# EAGLE design offsets-7x (EAGLE 7.7.0)
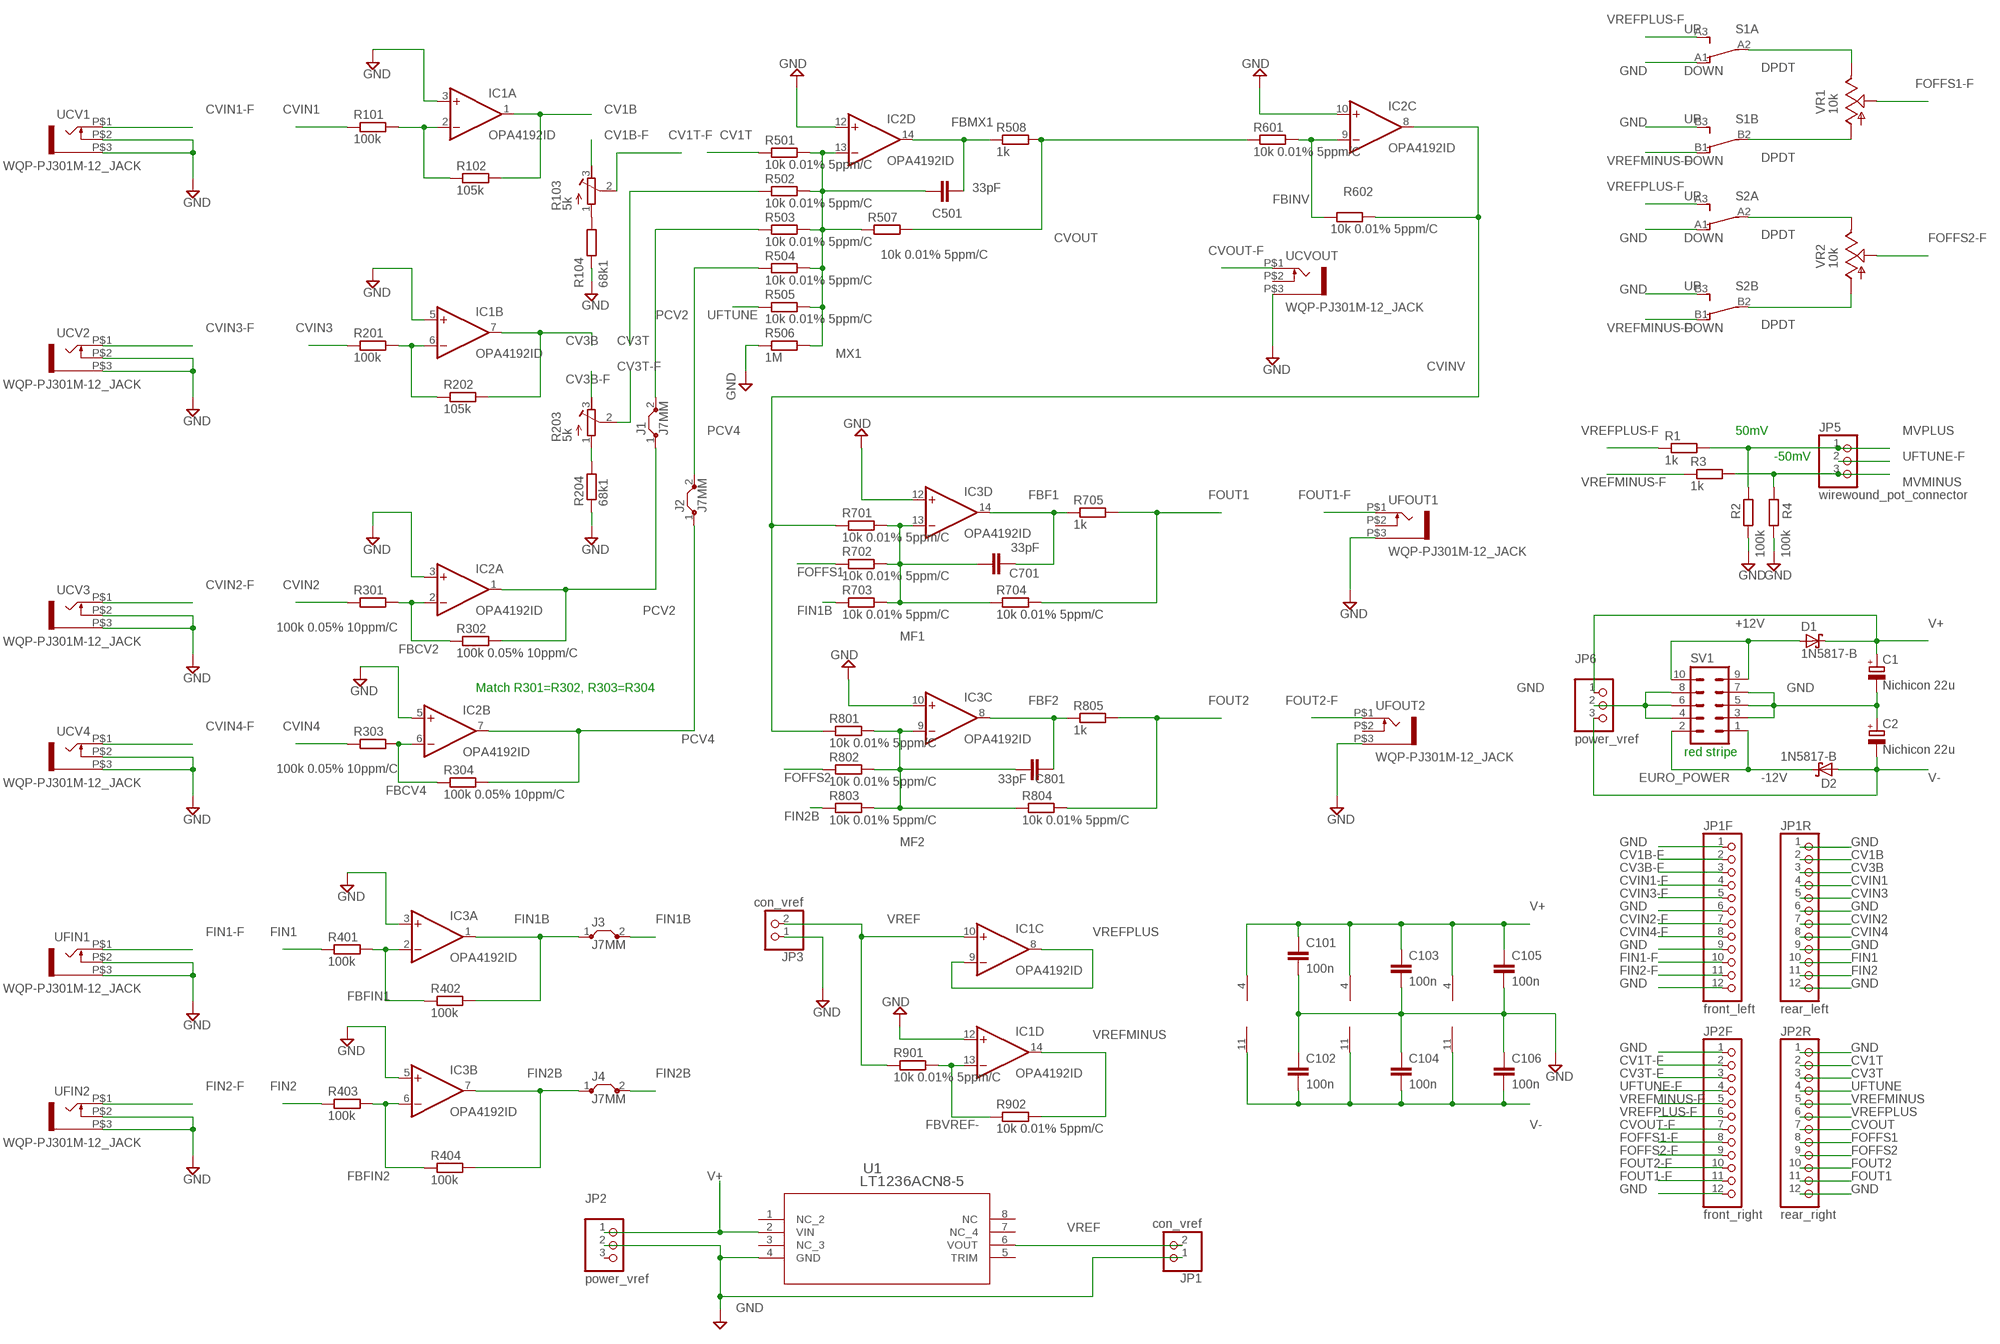
[diagram p0: schematic, sheet 1]

## Parts
C1  Nichicon 22u  CPOL-EUE2.5-5  [E2,5-5]
C2  Nichicon 22u  CPOL-EUE2.5-5  [E2,5-5]
C101  100n  C-EUC1206  [C1206]
C102  100n  C-EUC1206  [C1206]
C103  100n  C-EUC1206  [C1206]
C104  100n  C-EUC1206  [C1206]
C105  100n  C-EUC1206  [C1206]
C106  100n  C-EUC1206  [C1206]
C501  33pF  C-EUC0805K  [C0805K]
C701  33pF  C-EUC0805K  [C0805K]
C801  33pF  C-EUC0805K  [C0805K]
D1  1N5817-B  [DO41-7.6]
D2  1N5817-B  [DO41-7.6]
IC1  OPA4192ID  TL074D  [SO14]
IC2  OPA4192ID  TL074D  [SO14]
IC3  OPA4192ID  TL074D  [SO14]
J1  J7MM  [07]
J2  J7MM  [07]
J3  J7MM  [07]
J4  J7MM  [07]
JP1  con_vref  PINHD-1X2  [1X02]
JP1F  front_left  PINHD-1X12  [1X12]
JP1R  rear_left  PINHD-1X12  [1X12]
JP2  power_vref  PINHD-1X3  [1X03]
JP2F  front_right  PINHD-1X12  [1X12]
JP2R  rear_right  PINHD-1X12  [1X12]
JP3  con_vref  PINHD-1X2  [1X02]
JP5  wirewound_pot_connector  PINHD-1X3  [1X03]
JP6  power_vref  PINHD-1X3  [1X03]
R1  1k  R-EU_R0805W  [R0805W]
R2  100k  R-EU_R0805W  [R0805W]
R3  1k  R-EU_R0805W  [R0805W]
R4  100k  R-EU_R0805W  [R0805W]
R101  100k  R-EU_R0805W  [R0805W]
R102  105k  R-EU_R0805W  [R0805W]
R103  5k  R-TRIMM3296W  [RTRIM3296W]
R104  68k1  R-EU_R0805W  [R0805W]
R201  100k  R-EU_R0805W  [R0805W]
R202  105k  R-EU_R0805W  [R0805W]
R203  5k  R-TRIMM3296W  [RTRIM3296W]
R204  68k1  R-EU_R0805W  [R0805W]
R301  100k 0.05% 10ppm/C  R-EU_R0805W  [R0805W]
R302  100k 0.05% 10ppm/C  R-EU_R0805W  [R0805W]
R303  100k 0.05% 10ppm/C  R-EU_R0805W  [R0805W]
R304  100k 0.05% 10ppm/C  R-EU_R0805W  [R0805W]
R401  100k  R-EU_R0805W  [R0805W]
R402  100k  R-EU_R0805W  [R0805W]
R403  100k  R-EU_R0805W  [R0805W]
R404  100k  R-EU_R0805W  [R0805W]
R501  10k 0.01% 5ppm/C  R-EU_R0805W  [R0805W]
R502  10k 0.01% 5ppm/C  R-EU_R0805W  [R0805W]
R503  10k 0.01% 5ppm/C  R-EU_R0805W  [R0805W]
R504  10k 0.01% 5ppm/C  R-EU_R0805W  [R0805W]
R505  10k 0.01% 5ppm/C  R-EU_R0805W  [R0805W]
R506  1M  R-EU_R0805W  [R0805W]
R507  10k 0.01% 5ppm/C  R-EU_R0805W  [R0805W]
R508  1k  R-EU_R0805W  [R0805W]
R601  10k 0.01% 5ppm/C  R-EU_R0805W  [R0805W]
R602  10k 0.01% 5ppm/C  R-EU_R0805W  [R0805W]
R701  10k 0.01% 5ppm/C  R-EU_R0805W  [R0805W]
R702  10k 0.01% 5ppm/C  R-EU_R0805W  [R0805W]
R703  10k 0.01% 5ppm/C  R-EU_R0805W  [R0805W]
R704  10k 0.01% 5ppm/C  R-EU_R0805W  [R0805W]
R705  1k  R-EU_R0805W  [R0805W]
R801  10k 0.01% 5ppm/C  R-EU_R0805W  [R0805W]
R802  10k 0.01% 5ppm/C  R-EU_R0805W  [R0805W]
R803  10k 0.01% 5ppm/C  R-EU_R0805W  [R0805W]
R804  10k 0.01% 5ppm/C  R-EU_R0805W  [R0805W]
R805  1k  R-EU_R0805W  [R0805W]
R901  10k 0.01% 5ppm/C  R-EU_R0805W  [R0805W]
R902  10k 0.01% 5ppm/C  R-EU_R0805W  [R0805W]
S1  DPDT  DPDT-VERTICAL-DOWNTOP-SUBMINI  [DPDT-VERTICAL-TOP-SUBMINI-MULTICOMP]
S2  DPDT  DPDT-VERTICAL-DOWNTOP-SUBMINI  [DPDT-VERTICAL-TOP-SUBMINI-MULTICOMP]
SV1  EURO_POWER  EURO_POWER_HEADERREGULAR  [EURO_POWER_HEADER]
U1  LT1236ACN8-5  LT1236ACN8-10  [PDIP-8_N]
UCV1  WQP-PJ301M-12_JACK  [WQP-PJ301M-12_JACK]
UCV2  WQP-PJ301M-12_JACK  [WQP-PJ301M-12_JACK]
UCV3  WQP-PJ301M-12_JACK  [WQP-PJ301M-12_JACK]
UCV4  WQP-PJ301M-12_JACK  [WQP-PJ301M-12_JACK]
UCVOUT  WQP-PJ301M-12_JACK  [WQP-PJ301M-12_JACK]
UFIN1  WQP-PJ301M-12_JACK  [WQP-PJ301M-12_JACK]
UFIN2  WQP-PJ301M-12_JACK  [WQP-PJ301M-12_JACK]
UFOUT1  WQP-PJ301M-12_JACK  [WQP-PJ301M-12_JACK]
UFOUT2  WQP-PJ301M-12_JACK  [WQP-PJ301M-12_JACK]
VR1  10k  9MM_SNAP-IN_POT_  [9MM_SNAP-IN_POT]
VR2  10k  9MM_SNAP-IN_POT_  [9MM_SNAP-IN_POT]

## Nets
+12V: D1.A SV1.9 SV1.10
-12V: D2.C SV1.1 SV1.2
CV1B: IC1.1(A:OUT) JP1R.2 R102.2
CV1B-F: JP1F.2 R103.3(E)
CV1T: JP2R.2 R501.1
CV1T-F: JP2F.2 R103.2(S)
CV3B: IC1.7(B:OUT) JP1R.3 R202.2
CV3B-F: JP1F.3 R203.3(E)
CV3T: JP2R.3 R502.1
CV3T-F: JP2F.3 R203.2(S)
CVIN1: JP1R.4 R101.1
CVIN1-F: JP1F.4 UCV1.P$1
CVIN2: JP1R.7 R301.1
CVIN2-F: JP1F.7 UCV3.P$1
CVIN3: JP1R.5 R201.1
CVIN3-F: JP1F.5 UCV2.P$1
CVIN4: JP1R.8 R303.1
CVIN4-F: JP1F.8 UCV4.P$1
CVINV: IC2.8(C:OUT) R602.2 R701.1 R801.1
CVOUT: JP2R.7 R507.2 R508.2 R601.1
CVOUT-F: JP2F.7 UCVOUT.P$1
FBCV2: IC2.2(A:-IN) R301.2 R302.1
FBCV4: IC2.6(B:-IN) R303.2 R304.1
FBF1: C701.2 IC3.14(D:OUT) R705.1
FBF2: C801.2 IC3.8(C:OUT) R805.1
FBFIN1: IC3.2(A:-IN) R401.2 R402.1
FBFIN2: IC3.6(B:-IN) R403.2 R404.1
FBINV: IC2.9(C:-IN) R601.2 R602.1
FBMX1: C501.2 IC2.14(D:OUT) R508.1
FBVREF-: IC1.13(D:-IN) R901.2 R902.1
FIN1: JP1R.10 R401.1
FIN1-F: JP1F.10 UFIN1.P$1
FIN1B: IC3.1(A:OUT) J3.1 J3.2 R402.2 R703.1
FIN2: JP1R.11 R403.1
FIN2-F: JP1F.11 UFIN2.P$1
FIN2B: IC3.7(B:OUT) J4.1 J4.2 R404.2 R803.1
FOFFS1: JP2R.8 R702.1
FOFFS1-F: JP2F.8 VR1.2(S)
FOFFS2: JP2R.9 R802.1
FOFFS2-F: JP2F.9 VR2.2(S)
FOUT1: JP2R.11 R704.2 R705.2
FOUT1-F: JP2F.11 UFOUT1.P$1
FOUT2: JP2R.10 R804.2 R805.2
FOUT2-F: JP2F.10 UFOUT2.P$1
GND: C1.- C2.+ C101.2 C102.1 C103.2 C104.1 C105.2 C106.1 IC1.3(A:+IN) IC1.5(B:+IN) IC1.12(D:+IN) IC2.3(A:+IN) IC2.5(B:+IN) IC2.10(C:+IN) IC2.12(D:+IN) IC3.3(A:+IN) IC3.5(B:+IN) IC3.10(C:+IN) IC3.12(D:+IN) JP1.1 JP1F.1 JP1F.6 JP1F.9 JP1F.12 JP1R.1 JP1R.6 JP1R.9 JP1R.12 JP2.2 JP2F.1 JP2F.12 JP2R.1 JP2R.12 JP3.1 JP6.2 R2.1 R4.1 R104.1 R204.1 R506.1 S1.A1 S1.B3 S2.A1 S2.B3 SV1.3 SV1.4 SV1.5 SV1.6 SV1.7 SV1.8 U1.4(GND) UCV1.P$2 UCV1.P$3 UCV2.P$2 UCV2.P$3 UCV3.P$2 UCV3.P$3 UCV4.P$2 UCV4.P$3 UCVOUT.P$3 UFIN1.P$2 UFIN1.P$3 UFIN2.P$2 UFIN2.P$3 UFOUT1.P$3 UFOUT2.P$3
MF1: C701.1 IC3.13(D:-IN) R701.2 R702.2 R703.2 R704.1
MF2: C801.1 IC3.9(C:-IN) R801.2 R802.2 R803.2 R804.1
MVMINUS: JP5.3 R3.2 R4.2
MVPLUS: JP5.1 R1.2 R2.2
MX1: C501.1 IC2.13(D:-IN) R501.2 R502.2 R503.2 R504.2 R505.2 R506.2 R507.1
N$1: IC1.2(A:-IN) R101.2 R102.1
N$3: IC1.6(B:-IN) R201.2 R202.1
N$5: R103.1(A) R104.2
N$6: R203.1(A) R204.2
N$27: S1.A2 VR1.3(E)
N$28: S1.B2 VR1.1(A)
N$29: S2.A2 VR2.3(E)
N$30: S2.B2 VR2.1(A)
PCV2: IC2.1(A:OUT) J1.1 J1.2 R302.2 R503.1
PCV4: IC2.7(B:OUT) J2.1 J2.2 R304.2 R504.1
UFTUNE: JP2R.4 R505.1
UFTUNE-F: JP2F.4 JP5.2
V+: C1.+ C101.1 C103.1 C105.1 D1.C IC1.4(P:V+) IC2.4(P:V+) IC3.4(P:V+) JP2.1 JP6.1 U1.2(VIN)
V-: C2.- C102.2 C104.2 C106.2 D2.A IC1.11(P:V-) IC2.11(P:V-) IC3.11(P:V-) JP6.3
VREF: IC1.10(C:+IN) JP1.2 JP3.2 R901.1 U1.6(VOUT)
VREFMINUS: IC1.14(D:OUT) JP2R.5 R902.2
VREFMINUS-F: JP2F.5 R3.1 S1.B1 S2.B1
VREFPLUS: IC1.8(C:OUT) IC1.9(C:-IN) JP2R.6
VREFPLUS-F: JP2F.6 R1.1 S1.A3 S2.A3
Unconnected: JP2.3 U1.1(NC_2) U1.3(NC_3) U1.5(TRIM) U1.7(NC_4) U1.8(NC) UCVOUT.P$2 UFOUT1.P$2 UFOUT2.P$2

## Notes on the sheet
- 50mV
- -50mV
- Match R301=R302, R303=R304
- red stripe

## Library data of the parts
C1 C2 = rcl:CPOL-EU: POLARIZED CAPACITOR, European symbol; SPICEPREFIX: C
C101-C106 C501 C701 C801 = rcl:C-EU: CAPACITOR, European symbol; SPICEPREFIX: C
D1 D2 = diode:1N581*: 1.0A SCHOTTKY BARRIER RECTIFIER Source: http://www.diodes.com/datasheets/ds23001.pdf
IC1-IC3 = linear:TL074: OP AMP
J1-J4 = jumper:J: Bridge
JP1 JP3 = pinhead:PINHD-1X2: PIN HEADER
JP1F JP1R JP2F JP2R = pinhead:PINHD-1X12: PIN HEADER
JP2 JP5 JP6 = pinhead:PINHD-1X3: PIN HEADER
R1-R4 R101 R102 R104 R201 R202 R204 R301-R304 R401-R404 R501-R508 R601 R602 R701-R705 R801-R805 R901 R902 = rcl:R-EU_: RESISTOR, European symbol; SPICEPREFIX: R
R103 R203 = rcl:R-TRIMM: Trimm resistor; SPICEMODEL: X; SPICEPREFIXL: POT
S1 S2 = Switches:DPDT-VERTICAL-DOWN: Vertical DPDT switch in the down position.; SPICE: R{NAME}A {A.2.NET} {A.1.NET} 1\nR{NAME}B {B.2.NET} {B.1.NET} 1
SV1 = MusicThingModular:EURO_POWER_HEADER: Power Header 10 pin power header for Eurorack Power Supplies Variants with fatter pads for easier soldering, and the LOCK variant which has 5mil offset pins to hold the component in place before soldering
U1 = LT1236:LT1236ACN8-10; MANUFACTURER_PART_NUMBER: lt1236acn810; VENDOR: Linear Technology
UCV1-UCV4 UCVOUT UFIN1 UFIN2 UFOUT1 UFOUT2 = thonkiconn:WQP-PJ301M-12_JACK
VR1 VR2 = MusicThingModular:9MM_SNAP-IN_POT: 9mm vertical snap-in pot, Alpha / Panasonic style

## Board
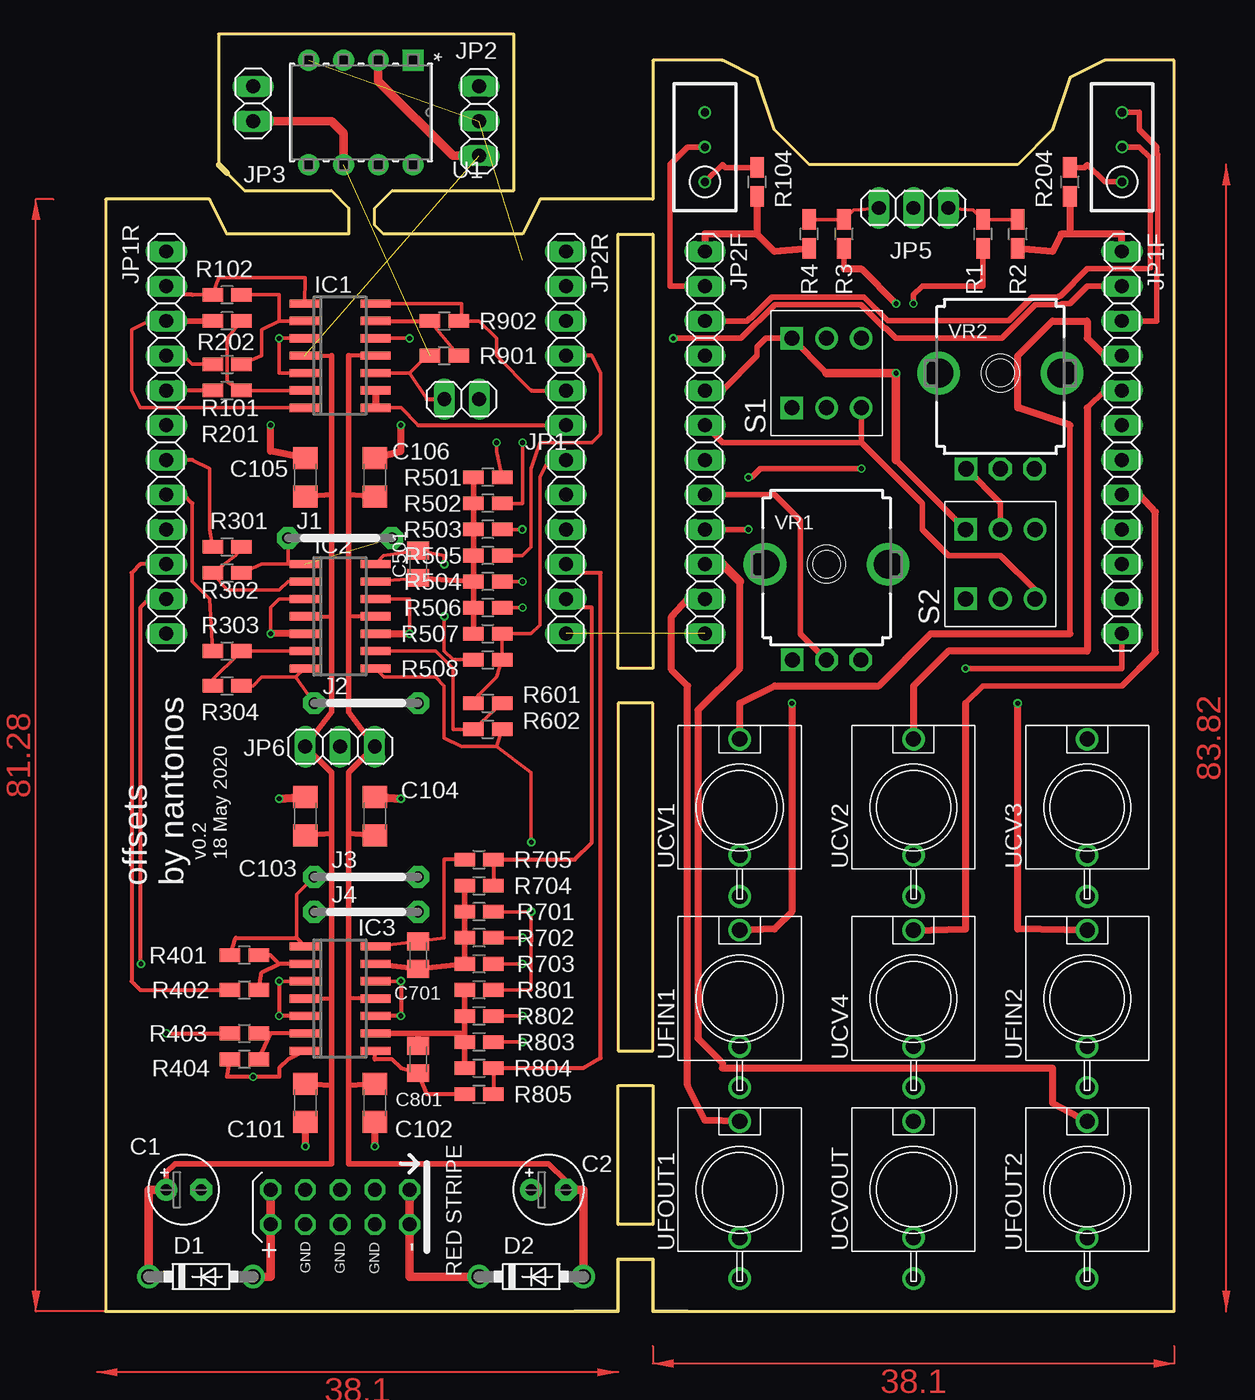
[diagram p1: board, top side]
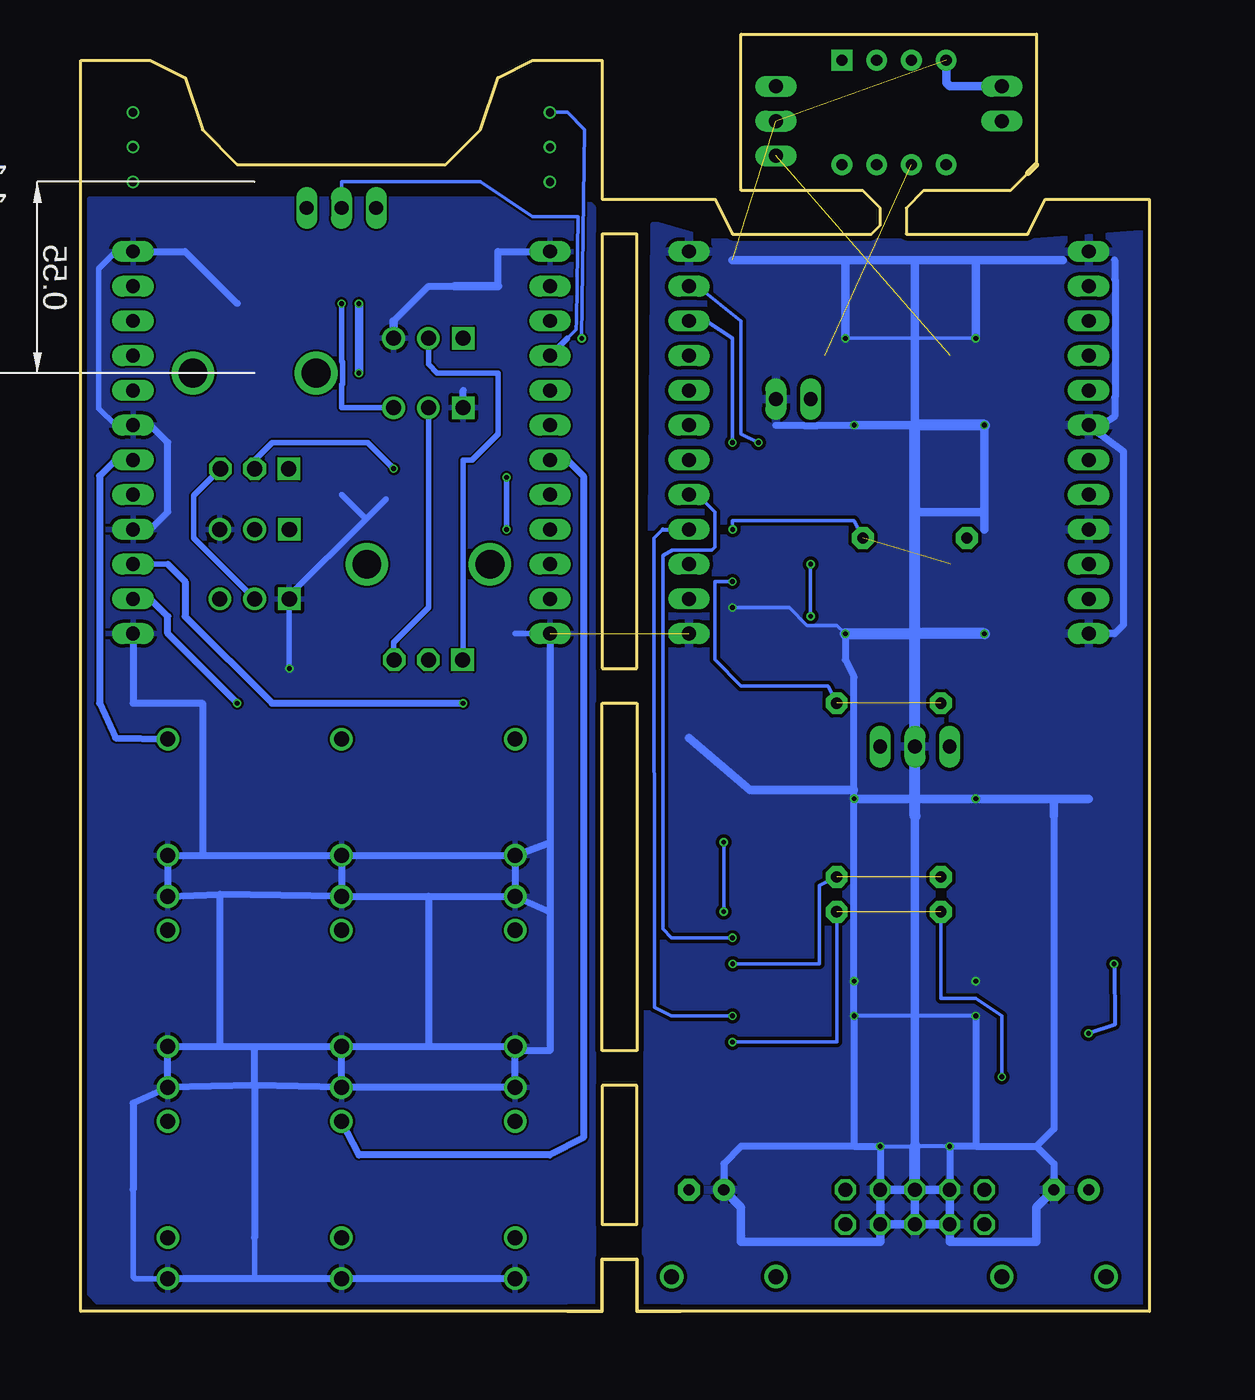
[diagram p2: board, bottom side, seen from below]

Size 78.11 x 93.34 mm. Coordinates in mm from the lower left corner, seen from the top.
Outline: 78.11,0 78.11,91.44 73.02,91.44 70.48,90.17 69.21,86.36 66.67,83.82 51.43,83.82 48.89,86.36 47.62,90.17 45.08,91.44 40,91.44 40,81.28 31.75,81.28 30.48,78.74 20.32,78.74 19.68,79.38 19.68,80.64 20.95,81.92 29.84,81.92 29.84,93.34 8.25,93.34 8.25,83.82 8.89,83.19 10.16,81.92 16.51,81.92 17.78,80.64 17.78,78.74 8.89,78.74 7.62,81.28 0,81.28 0,0 34.29,0 37.46,0 37.46,3.81 40,3.81 40,0 42.54,0 78.11,0
Outline: 37.46,78.74 40,78.74 40,46.99 37.46,46.99 37.46,78.74
Outline: 37.46,44.45 37.46,19.05 40,19.05 40,44.45 37.46,44.45
Outline: 37.46,6.35 37.46,16.51 40,16.51 40,6.35 37.46,6.35
Copper layers (1*16): Top 0.035559375mm / dielectric 1.6mm / Bottom 0.035559375mm
Design rules "oshpark-2layer": minimum track width 6mil, minimum drill 10mil, track to track 6mil, track to pad 6mil, pad to pad 6mil, via to via 6mil, smd to smd 6mil, copper to edge 15mil, drill to drill 6mil, minimum pad ring 5mil, minimum via ring 5mil, stop-mask expansion 2.5mil, vias tented up to drill 0mil, thermal gap 10mil

### Footprints (pad centres in the part's own frame; a part is rotated, then mirrored left to right if it is on the bottom)
E2,5-5 = drill 0.813 pad 1.6: + -1.27,0 | drill 0.813 pad 1.6 octagon: - 1.27,0
C1206 = smd 1.6 x 1.8: 1 -1.4,0; 2 1.4,0
C0805K = smd 1.3 x 1.6: 1 -1,0; 2 1,0
DO41-7.6 = drill 1.1 pad 1.7: A 3.81,0; C -3.81,0
SO14 = smd 0.6 x 2.2: 1 -3.81,-2.6; 2 -2.54,-2.6; 3 -1.27,-2.6; 4 0,-2.6; 5 1.27,-2.6; 6 2.54,-2.6; 7 3.81,-2.6; 8 3.81,2.6; 9 2.54,2.6; 10 1.27,2.6; 11 0,2.6; 12 -1.27,2.6; 13 -2.54,2.6; 14 -3.81,2.6
07 = drill 0.813 pad 1.6 octagon: 1 -3.81,0; 2 3.81,0
1X02 = drill 1.016 long: 1 -1.27,0; 2 1.27,0
1X12 = drill 1.016 long: 1 -13.97,0; 2 -11.43,0; 3 -8.89,0; 4 -6.35,0; 5 -3.81,0; 6 -1.27,0; 7 1.27,0; 8 3.81,0; 9 6.35,0; 10 8.89,0; 11 11.43,0; 12 13.97,0
1X03 = drill 1.016 long: 1 -2.54,0; 2 0,0; 3 2.54,0
R0805W = smd 1.5 x 1: 1 -1.052,0; 2 1.052,0
RTRIM3296W = drill 0.61: 1 0,-2.54; 2 0,0; 3 0,2.54
DPDT-VERTICAL-TOP-SUBMINI-MULTICOMP = drill 1.1 square: A1 -2.54,2.54; B1 2.54,2.54 | drill 1.1: A2 -2.54,0; A3 -2.54,-2.54; B2 2.54,0; B3 2.54,-2.54
EURO_POWER_HEADER = drill 1.016 octagon: 1 -5.08,-1.27; 2 -5.08,1.27; 3 -2.54,-1.27; 4 -2.54,1.27; 5 0,-1.27; 6 0,1.27; 7 2.54,-1.27; 8 2.54,1.27; 9 5.08,-1.27; 10 5.08,1.27
PDIP-8_N = drill 0.813 pad 1.524 square: 1 -7.62,7.62 | drill 0.813 pad 1.524: 2 -7.62,5.08; 3 -7.62,2.54; 4 -7.62,0; 5 0,0; 6 0,2.54; 7 0,5.08; 8 0,7.62
WQP-PJ301M-12_JACK = drill 1.1: P$1 0,5; P$2 0,-3.5; P$3 0,-6.5
9MM_SNAP-IN_POT = drill 1.1 square: 1 -2.5,-7 | drill 1.1 octagon: 2 0,-7; 3 2.5,-7 | drill 2.1 pad 2.794: CHASSIS1 -4.5,0; CHASSIS2 4.5,0

### Placement (x,y rotation side)
C1  5.71,8.89 0 top
C2  32.38,8.89 0 top
C101  14.6,15.24 270 top
C102  19.68,15.24 90 top
C103  14.6,36.2 90 top
C104  19.68,36.2 270 top
C105  14.6,60.96 90 top
C106  19.68,60.96 270 top
C501  22.86,54.61 90 top
C701  22.86,26.04 90 top
C801  22.86,18.41 270 top
D1  6.98,2.54 0 top
D2  31.11,2.54 0 top
IC1  17.14,69.85 270 top
IC2  17.14,50.8 270 top
IC3  17.14,22.86 270 top
J1  17.14,56.52 0 top
J2  19.05,44.45 0 top
J3  19.05,31.75 0 top
J4  19.05,29.21 0 top
JP1  26.03,66.67 180 top
JP1F  74.3,63.5 270 top
JP1R  4.44,63.5 270 top
JP2  27.3,87 90 top
JP2F  43.81,63.5 270 top
JP2R  33.65,63.5 270 top
JP3  10.79,88.27 270 top
JP5  59.05,80.64 180 top
JP6  17.14,41.27 0 top
R1  64.14,78.74 90 top
R2  66.67,78.74 90 top
R3  53.97,78.74 90 top
R4  51.43,78.74 90 top
R101  8.89,69.22 0 top
R102  8.89,74.3 180 top
R103  43.81,85.09 0 top
R104  47.62,82.55 90 top
R201  8.89,67.31 0 top
R202  8.89,72.39 180 top
R203  74.3,85.09 0 top
R204  70.48,82.55 90 top
R301  8.89,55.88 0 top
R302  8.89,53.98 0 top
R303  8.89,48.26 0 top
R304  8.89,45.72 0 top
R401  10.16,23.5 0 top
R402  10.16,26.04 180 top
R403  10.16,20.32 0 top
R404  10.16,18.41 180 top
R501  27.94,60.96 180 top
R502  27.94,59.05 180 top
R503  27.94,57.15 180 top
R504  27.94,53.34 180 top
R505  27.94,55.24 180 top
R506  27.94,51.44 180 top
R507  27.94,49.53 0 top
R508  27.94,47.62 0 top
R601  27.94,44.45 0 top
R602  27.94,42.55 0 top
R701  27.3,29.21 180 top
R702  27.3,27.3 180 top
R703  27.3,25.4 180 top
R704  27.3,31.11 0 top
R705  27.3,33.02 0 top
R801  27.3,23.5 180 top
R802  27.3,21.59 180 top
R803  27.3,19.68 180 top
R804  27.3,17.78 0 top
R805  27.3,15.88 0 top
R901  24.77,69.85 0 top
R902  24.77,72.39 0 top
S1  52.7,68.58 90 top
S2  65.4,54.61 90 top
SV1  17.14,7.62 180 top
U1  14.86,83.82 270 top
UCV1  46.36,36.83 0 top
UCV2  59.05,36.83 0 top
UCV3  71.75,36.83 0 top
UCV4  59.05,22.86 0 top
UCVOUT  59.05,8.89 0 top
UFIN1  46.36,22.86 0 top
UFIN2  71.75,22.86 0 top
UFOUT1  46.36,8.89 0 top
UFOUT2  71.75,8.89 0 top
VR1  52.7,54.61 0 top
VR2  65.4,68.58 0 top

### Tracks (layer width: path | path; a pad name or v marks a point on that pad's centre or on a via)
+12V
  Top 0.61: SV1.9 SV1.10 12.06,2.54 D1.A
-12V
  Top 0.61: SV1.1 SV1.2 22.22,2.54 D2.C
CV1B
  Top 0.254: 6.35,74.3 R102.2 8.25,75.56 14.6,75.56 IC1.1
  Top 0.305: 6.35,74.3 5.08,74.3 JP1R.2
CV1B-F  (via drill 0.35)
  Top 0.406: v41.5,71.12 46.46,71.12 48.93,73.58 55.21,73.58 56.94,71.86 57.05,71.86 57.78,71.12 65.51,71.12 67.98,73.58 69.85,73.58 69.93,73.66 70.48,73.66 71.75,74.93 JP1F.2
  Bottom 0.254: v41.5,71.12 41.27,86.36 42.54,87.63 R103.3
CV1T  (via drill 0.35)
  Top 0.254: R501.1 28.57,62.87 v28.57,63.5
  Bottom 0.254: 33.02,74.93 29.84,72.39 29.84,64.14 v28.57,63.5
  Bottom 0.305: JP2R.2 33.02,74.93
CV1T-F
  Top 0.406: R103.2 42.54,85.09 41.27,83.82 41.27,74.93 JP2F.2
CV3B
  Top 0.254: IC1.7 2.54,66.04 1.9,67.31 1.9,71.75 3.17,72.39
  Top 0.305: JP1R.3 3.17,72.39
  Top 0.406: R202.2 JP1R.3
CV3B-F
  Top 0.406: R203.3 75.56,87.63 75.56,86.36 76.83,85.09 76.83,84.61 76.91,84.53 76.91,76 76.83,75.92 76.83,72.39 JP1F.3
CV3T  (via drill 0.35)
  Top 0.254: R502.1 30.48,59.05 v30.48,63.5
  Bottom 0.254: v30.48,63.5 30.48,71.12 32.38,72.39
  Bottom 0.305: JP2R.3 32.38,72.39
CV3T-F
  Top 0.254: 76.2,76.2 76.43,76.2
  Top 0.406: JP2F.3 46.89,72.39 47.11,72.61 47.16,72.61 48.7,74.14 55.45,74.14 57.17,72.41 66.02,72.41 67.74,74.14 69.62,74.14 69.7,74.22 69.77,74.22 71.75,76.2 76.2,76.2 76.35,76.35 76.35,84.3 75.56,85.09 R203.2
CVIN1
  Top 0.254: R101.1 6.35,69.22 5.71,69.85
  Top 0.305: JP1R.4 5.71,69.85
CVIN1-F
  Top 0.406: 70.48,49.53 70.48,64.77 | JP1F.4 73.02,69.85
  Top 0.508: UCV1.P$1 46.36,44.45 48.89,45.72 56.52,45.72 60.33,49.53 70.48,49.53 | 70.48,64.77 66.67,66.04 66.67,69.85 69.21,72.39 71.75,72.39 71.75,71.12 73.02,69.85
CVIN2
  Top 0.254: R301.1 7.62,57.15 7.62,61.59 6.35,62.23
  Top 0.305: 6.35,62.23 JP1R.7
CVIN2-F
  Bottom 0.406: JP1F.7 75.56,62.23
  Bottom 0.508: 75.56,62.23 76.73,61.06 76.73,44.45 75.56,41.91 UCV3.P$1
CVIN3
  Top 0.305: R201.1 JP1R.5
CVIN3-F
  Top 0.406: 71.75,66.04 73.02,67.31 JP1F.5
  Top 0.508: UCV2.P$1 59.05,45.72 61.59,48.26 71.75,48.26 71.75,66.04
CVIN4
  Top 0.254: R303.1 7.62,52.07 6.35,53.34 6.35,59.05
  Top 0.305: 6.35,59.05 5.71,59.69 JP1R.8
CVIN4-F
  Top 0.406: 75.56,46.99 74.3,45.72 64.14,45.72 62.86,44.45 | JP1F.8 75.56,59.69
  Top 0.508: UCV4.P$1 62.86,27.94 62.86,44.45 | 75.56,46.99 76.73,48.16 76.73,58.42 75.56,59.69
CVINV  (via drill 0.35)
  Top 0.254: R801.1 31.11,23.5 31.11,27.01 31.14,27.03 31.14,27.58 31.11,27.6 v31.11,29.21 R701.1 | IC2.8 20.38,46.35 24.13,46.35 24.77,45.72 24.77,41.91 26.03,41.27 28.57,41.27 | 28.57,41.27 R602.2 | 28.57,41.27 31.11,39.37 v31.11,34.29
  Bottom 0.254: v31.11,29.21 v31.11,34.29
CVOUT
  Top 0.254: 32.38,62.23 31.75,60.96 31.75,50.16 31.11,49.53 R507.2 R508.2 28.57,46.35 27.3,45.09 R601.1
  Top 0.305: JP2R.7 32.38,62.23
CVOUT-F
  Bottom 0.406: JP2F.7 42.54,62.23
  Bottom 0.508: 42.54,62.23 41.38,61.06 41.38,12.7 43.81,11.43 57.78,11.43 UCVOUT.P$1
FBCV2
  Top 0.254: R301.2 9.52,55.24 R302.1 8.89,52.7 12.7,52.7 13.33,53.34 IC2.2
FBCV4
  Top 0.254: R304.1 7.63,45.95 R303.2 IC2.6
FBF1
  Top 0.254: 24.77,33.02 24.77,27.3 C701.2 IC3.14
  Top 0.305: R705.1 24.77,33.02
FBF2
  Top 0.305: IC3.8 19.68,18.41 20.95,18.41 21.59,17.78 C801.2 23.49,15.88 R805.1
FBFIN1
  Top 0.305: IC3.2 12.7,25.4 | 12.7,25.4 12.06,26.04 R402.1 | R401.2 11.43,24.77 12.7,25.4
FBFIN2
  Top 0.305: IC3.6 12.06,20.32 | 12.06,20.32 R403.2 | R404.1 12.06,20.32
FBINV
  Top 0.254: R601.2 R602.1 25.4,42.55 25.4,46.99 24.13,48.26 IC2.9
FBMX1  (via drill 0.35)
  Top 0.254: IC2.14 20.32,55.24 C501.2 24.77,55.24 v24.77,54.61 | v24.77,50.8 24.77,48.26 25.4,47.62 R508.1
  Bottom 0.254: v24.77,54.61 v24.77,50.8
FBVREF-
  Top 0.254: R901.2 R902.1
  Top 0.305: IC1.13 R902.1
FIN1
  Top 0.305: R401.1 2.54,23.5 1.9,24.13 1.9,53.98 2.54,54.61 JP1R.10
FIN1-F  (via drill 0.35)
  Top 0.508: v50.17,44.45 50.17,29.21 48.89,27.94 UFIN1.P$1
  Bottom 0.406: JP1F.10 71.75,54.61
  Bottom 0.508: 71.75,54.61 70.48,53.34 70.48,50.8 64.14,44.45 v50.17,44.45
FIN1B  (via drill 0.35)  (1 unrouted)
  Top 0.254: R703.1 v30.46,25.4 30.48,25.4 | J3.1 13.97,30.48 13.97,27.3
  Top 0.305: R402.2 9.52,27.3 13.97,27.3 IC3.1
  Bottom 0.254: v30.46,25.4 24.13,25.4 24.13,31.11 J3.2
FIN2  (via drill 0.35)
  Top 0.305: v2.59,25.4 2.54,25.4 2.54,51.44 3.17,52.07 JP1R.11 | v4.44,20.32 R403.1
  Bottom 0.305: v2.59,25.4 2.54,20.95 v4.44,20.32
FIN2-F  (via drill 0.35)
  Top 0.508: UFIN2.P$1 66.67,27.94 v66.67,44.45
  Bottom 0.406: JP1F.11 73.02,52.07
  Bottom 0.508: v66.67,44.45 71.75,49.53 71.75,50.8 73.02,52.07
FIN2B  (via drill 0.35)  (1 unrouted)
  Top 0.254: R803.1 v30.48,19.68
  Top 0.305: IC3.7 13.33,18.41 12.7,17.78 12.7,17.14 v10.79,17.14 8.89,17.14 R404.2
  Bottom 0.254: v30.48,19.68 22.86,19.68 J4.2 | J4.1 15.24,22.86 12.7,22.86 10.79,21.59 v10.79,17.14
FOFFS1  (via drill 0.35)
  Top 0.254: R702.1 v30.48,27.3
  Bottom 0.254: v30.48,27.3 34.92,27.3 35.56,27.94 35.56,55.24 34.85,55.65 31.98,55.65 31.75,55.88 31.75,58.42 33.02,59.69
  Bottom 0.305: JP2R.8 33.02,59.69
FOFFS1-F
  Top 0.406: VR1.2 50.8,49.52 50.8,57.78 48.89,59.69 JP2F.8
FOFFS2  (via drill 0.35)
  Top 0.254: v30.48,21.59 R802.1
  Bottom 0.254: 35.58,57.15 36.22,56.52 36.19,22.23 34.92,21.59 v30.48,21.59
  Bottom 0.305: 35.58,57.15 JP2R.9
FOFFS2-F  (via drill 0.35)
  Top 0.406: v55.24,61.59 47.88,61.59 47.24,60.96 v46.99,60.96 | JP2F.9 v46.99,57.15
  Bottom 0.406: VR2.2 65.4,62.23 64.14,63.5 57.15,63.5 v55.24,61.59 | v46.99,60.96 v46.99,57.15
FOUT1
  Top 0.305: R704.2 R705.2 34.29,33.02 35.56,34.29 35.56,51.44 34.29,51.44 JP2R.11
FOUT1-F
  Top 0.406: JP2F.11 42.54,52.07
  Top 0.508: UFOUT1.P$1 43.81,13.97 42.54,16.51 42.54,45.72 41.38,46.89 41.38,50.8 42.54,52.07
FOUT2
  Top 0.305: R805.2 R804.2 34.92,17.78 36.19,18.52 36.19,53.98 34.29,53.98 JP2R.10
FOUT2-F
  Top 0.406: JP2F.10 45.08,54.61
  Top 0.508: 46.36,53.34 46.36,46.99 43.3,43.94 43.3,19.95 45.08,18.17 45.08,17.78 69.21,17.78 69.21,15.24 UFOUT2.P$1
  Top 0.61: 45.08,54.61 46.36,53.34
GND  (via drill 0.35)  (3 unrouted)
  Top 0.254: IC2.12 22.22,52.07 v22.22,49.53 | IC2.3 12.7,52.07 12.06,51.44 v12.06,49.53 | 21.59,64.14 v21.59,64.77 | 12.06,63.5 v12.06,64.77 | IC1.5 12.7,68.58 v12.7,71.12 IC1.3 | IC1.12 v22.22,71.12 | v30.48,51.44 R506.1 | IC3.3 v12.7,24.13 | IC3.12 v21.59,24.13
  Top 0.305: IC3.5 v12.7,21.59 v12.7,24.13 | IC3.10 v21.59,21.59 v21.59,24.13
  Top 0.406: JP1F.12 74.3,46.99 v62.86,46.99
  Top 0.508: R104.1 47.62,78.74 | 47.62,78.74 43.81,78.74 JP2F.1 | R2.1 69.21,77.47 69.85,78.74 70.48,78.74 | R4.1 48.89,77.47 47.62,78.74 | IC2.5 v12.06,49.53 | IC2.10 v22.22,49.53 | C101.2 v14.6,12.06 | C102.1 v19.68,12.06 | C105.2 12.06,62.87 v12.06,64.77 | C106.1 21.59,62.87 v21.59,64.77 | JP1F.1 74.3,78.74 70.48,78.74 | R204.1 70.48,78.74
  Top 0.61: v21.59,37.47 C104.1 | v12.7,37.47 C103.2
  Bottom 0.254: v22.22,71.12 17.14,71.12 v12.7,71.12 | v22.22,49.53 22.84,50.14 25.04,50.14 26.33,51.44 v30.48,51.44
  Bottom 0.305: v12.7,21.59 17.14,21.59 v21.59,21.59 | v14.6,12.06 17.14,12.06 v19.68,12.06
  Bottom 0.406: 57.27,57.9 62.86,52.3 v62.86,46.99 | 57.27,57.9 55.78,59.39 | JP1F.6 75.56,64.77 76.78,65.99 76.78,76.2 75.56,77.47 JP1F.1 | 59.05,59.69 57.27,57.9 | JP2F.12 46.36,49.53 | 65.4,5.39 65.4,2.39 | 74.3,8.89 74.3,2.54 74.14,2.39 UFOUT2.P$3
  Bottom 0.508: JP1F.12 74.3,44.45 69.21,44.45 69.21,33.33 | 69.21,33.33 UCV3.P$2 UCV3.P$3 67.95,30.48 | 69.21,33.33 UCV2.P$2 | UCV2.P$2 UCV1.P$2 | UCV1.P$2 UCV1.P$3 | UCV2.P$2 UCV2.P$3 | UFIN1.P$2 46.36,19.05 43.81,19.05 43.81,29.21 | JP2F.12 43.81,34.29 | 43.81,34.29 43.81,29.21 | UCV4.P$2 52.7,19.36 | 52.7,19.36 UFIN1.P$2 | 67.95,19.36 UFIN2.P$2 UFIN2.P$3 | 67.95,19.36 65.4,19.36 | 65.4,19.36 UCV4.P$2 | UFIN1.P$2 UFIN1.P$3 UCV4.P$3 | UCV4.P$3 UCV4.P$2 | 67.95,30.48 67.95,19.36 | 74.3,8.89 74.3,15.24 UFIN2.P$3 | 73.02,57.15 71.75,58.42 71.75,63.5 73.02,64.77 JP1F.6 | S1.A1 50.17,67.31 | JP2F.1 47.62,77.47 47.62,74.93 | 50.8,74.93 52.7,74.93 55.24,72.39 | UCV2.P$3 52.7,30.33 | 52.7,30.33 UCV1.P$3 | UCV2.P$3 67.95,30.48 | 52.7,30.33 52.7,19.36 | 65.4,16.51 65.4,5.39 | 65.4,16.51 65.4,19.36 | UFOUT1.P$3 UCVOUT.P$3 65.4,2.39 UFOUT2.P$3 | UCV1.P$2 43.81,34.29 | UCV1.P$3 43.81,29.21 | JP1F.1 70.48,77.47 66.67,73.66 | UCV4.P$3 65.4,16.51 | 65.4,16.51 UFIN2.P$3 | v12.7,21.59 12.7,12.06 | 12.7,12.06 v14.6,12.06 SV1.7 | 21.59,12.06 v21.59,21.59 v21.59,24.13 v21.59,37.47 21.59,38.1 21.59,46.35 22.22,47.62 v22.22,49.53 | 21.59,12.06 v19.68,12.06 SV1.3 | 27.3,64.77 25.27,64.77 25.25,64.75 24.28,64.75 24.26,64.77 v21.59,64.77 | 12.7,12.06 8.25,12.06 | 8.25,12.06 6.98,10.79 C1.- | 21.59,12.06 29.84,12.06 31.11,10.79 C2.+ | 6.98,36.2 6.98,13.34 8.25,12.06 | JP1R.12 2.54,49.53 1.9,50.16 1.9,62.87 4.04,64.47 2.54,65.41 2.54,66.8 2.52,66.83 2.52,75.41 2.54,75.44 2.54,76.83
  Bottom 0.61: SV1.4 SV1.6 | SV1.6 SV1.8 | SV1.4 SV1.3 SV1.5 | SV1.6 SV1.5 | SV1.8 SV1.7 SV1.5 | C1.- 8.25,7.62 8.25,5.08 14.6,5.08 SV1.8 | SV1.4 19.68,5.08 29.84,5.08 29.84,7.62 C2.+ | 17.14,36.2 17.14,21.59 17.14,12.06 | v21.59,64.77 17.14,64.77 17.14,71.12 17.14,76.83 | 30.48,76.83 22.22,76.83 | 22.22,76.83 17.14,76.83 | 17.14,76.83 12.7,76.83 | 12.7,76.83 6.35,76.83 | v22.22,71.12 22.22,76.83 | v12.7,71.12 12.7,76.83 | v12.06,64.77 12.06,58.42 | 12.06,58.42 12.06,57.15 | 12.06,58.42 17.14,58.42 | v21.59,37.47 v12.7,37.47 6.98,37.47 | 6.98,37.47 4.44,37.47 | 6.98,37.47 6.98,36.2 | JP6.2 17.14,40.01 | 33.65,41.91 29.21,38.1 21.59,38.1 | 50.8,74.93 47.62,74.93 | U1.4 14.86,89.79 14.6,89.53 JP3.1 | 55.24,72.39 S1.B3
  Bottom 0.813: SV1.5 17.14,12.06 | 17.14,36.2 17.14,40.01 17.14,49.53 | 17.14,49.53 17.14,58.42 17.14,64.77 v12.06,64.77 | v22.22,49.53 17.14,49.53 | v12.06,49.53 17.14,49.53
  pour Bottom (isolate 0.254): 36.83,0.64 0.63,0.64 0.63,78.74 8.89,78.11 31.75,78.11 36.19,79.38
  pour Bottom: 77.47,81.28 41.27,81.28 40.64,80.64 40.64,0.64 76.83,0.64 77.47,1.27
MF1
  Top 0.406: R704.1 R701.2 R702.2 R703.2 C701.1 IC3.13
MF2
  Top 0.305: IC3.9 22.86,20.32 26.03,20.32 26.23,19.75 | 26.23,19.75 R803.2 | R802.2 26.24,20.32 26.23,19.75
  Top 0.406: R801.2 R802.2 R803.2 R804.1 | IC3.9 26.24,20.32 | 22.86,20.32 C801.1
MVMINUS
  Top 0.254: R4.2 R3.2 54.67,80.49 JP5.3
MVPLUS
  Top 0.254: JP5.1 63.44,80.49 R1.2 R2.2
MX1
  Top 0.254: IC2.13 C501.1 | 26.67,53.35 R504.2
  Top 0.406: C501.1 26.67,53.35 | R501.2 R502.2 R503.2 R505.2 R504.2 R506.2 R507.1
N$1
  Top 0.254: R102.1 12.7,74.3 12.7,72.39 | 12.7,72.39 IC1.2 | R101.2 11.43,69.85 11.43,71.75 12.7,72.39
N$3
  Top 0.254: IC1.6 R201.2 8.89,67.94 8.89,71.12 R202.1
N$5
  Top 0.406: R103.1 45.08,83.82 45.3,83.6 R104.2
N$6
  Top 0.406: R203.1 73.02,82.55 71.75,83.82 71.54,83.6 R204.2
N$27
  Bottom 0.406: S1.A2 52.7,51.44 55.24,48.9 55.24,47.65 VR1.3
N$28
  Bottom 0.406: S1.B2 52.7,69.22 52.07,68.58 47.62,68.58 47.62,64.14 49.53,62.23 50.17,62.23 50.17,47.65 VR1.1
N$29
  Bottom 0.406: S2.A2 69.85,56.52 69.85,59.63 VR2.3
N$30
  Top 0.406: VR2.1 65.4,59.08 S2.B2
PCV2  (via drill 0.35)  (1 unrouted)
  Top 0.254: IC2.1 13.33,54.61 | 13.33,54.61 11.43,54.61 R302.2 | R503.1 v30.46,57.15 30.48,57.15 | J1.1 13.33,54.61
  Bottom 0.254: v30.46,57.15 30.48,57.78 21.59,57.78 J1.2
PCV4  (via drill 0.35)  (1 unrouted)
  Top 0.254: IC2.7 13.91,46.35 | 13.91,46.35 11.43,46.35 10.79,45.72 R304.2 | v30.48,53.34 R504.1 | J2.1 13.91,46.35
  Bottom 0.254: v30.48,53.34 31.75,53.34 31.75,47.62 29.84,45.72 23.49,45.72 J2.2
UFTUNE
  Top 0.254: 35.56,69.85 36.19,68.58 36.19,64.14 35.56,63.5 31.75,63.5 31.11,61.59 31.11,55.88 30.48,55.24 R505.1
  Top 0.305: 35.56,69.85 JP2R.4
UFTUNE-F
  Bottom 0.254: JP5.2 59.05,82.55 48.89,82.55 45.08,80.01 41.78,80.01 41.89,72.4 41.9,71.77 42.54,71.12
  Bottom 0.406: JP2F.4 42.54,71.12
V+  (1 unrouted)
  Top 0.305: IC2.4 16.51,50.8 | IC1.4 16.51,69.85 | IC3.4 16.51,22.86
  Top 0.406: C1.+ 4.44,10.16 5.08,10.79 16.51,10.79 16.51,16.51 | 16.51,16.51 16.51,22.86 16.51,34.92 | 16.51,34.92 16.51,39.37 JP6.1 16.51,43.81 16.51,50.8 16.51,59.69 | 16.51,69.85 16.51,59.69 | C101.1 16.51,16.51 | C103.1 16.51,34.92 | C105.1 16.51,59.69
  Top 0.61: C1.+ 3.17,8.89 D1.C | U1.2 19.94,89.92 25.4,84.45 JP2.1
V-
  Top 0.305: IC2.11 17.78,50.8 | IC1.11 17.78,69.85 | IC3.11 17.78,22.86
  Top 0.406: C2.- 33.65,9.53 32.38,10.79 17.78,10.79 17.78,16.51 | 17.78,16.51 17.78,22.86 17.78,34.92 | 17.78,34.92 17.78,39.37 JP6.3 17.78,43.81 17.78,50.8 17.78,59.69 | 17.78,69.85 17.78,59.69 | C102.2 17.78,16.51 | C104.2 17.78,34.92 | C106.2 17.78,59.69
  Top 0.61: C2.- 34.92,8.89 D2.A
VREF  (1 unrouted)
  Top 0.152: 23.49,69.85 R901.1
  Top 0.254: IC1.10 22.22,68.58 | 22.22,68.58 23.49,69.85 | 22.22,68.58 23.49,66.67
  Top 0.305: 23.49,66.67 JP1.2
  Top 0.61: 17.14,84.07 U1.6 17.4,86.11 16.51,87 JP3.2
VREFMINUS
  Top 0.152: 27.3,72.39 26.03,72.39 R902.2
  Top 0.254: IC1.14 26.03,73.66 26.03,72.39 | R902.2 27.3,72.39 28.57,71.12 28.57,69.85 31.11,67.31
  Top 0.305: 31.11,67.31 JP2R.5
VREFMINUS-F  (via drill 0.35)
  Top 0.406: 57.78,62.23 S2.B1 | JP2F.5 45.08,67.31 47.62,69.85 47.62,70.48 48.26,71.12 S1.B1 52.7,68.58 | R3.1 53.97,76.2
  Top 0.508: 53.97,76.2 55.24,76.2 v57.78,73.66
  Top 0.61: 52.7,68.58 v57.78,68.58 57.78,62.23
  Bottom 0.61: v57.78,73.66 v57.78,68.58
VREFPLUS
  Top 0.254: 22.86,64.77 21.59,66.04 IC1.8
  Top 0.305: 22.86,64.77 JP2R.6
  Top 0.508: IC1.9 IC1.8
VREFPLUS-F  (via drill 0.35)
  Top 0.406: v59.05,73.66 59.05,74.3 59.69,74.93 64.14,74.93 R1.1 | S2.A3 67.95,52.7 65.4,55.24 61.59,55.24 59.69,57.15 59.69,59.05 58.59,60.16 58.42,60.33 55.24,63.5 | JP2F.6 45.08,63.5 55.24,63.5 | S1.A3 55.24,63.5
  Bottom 0.406: v59.05,73.66 59.05,69.44 58.99,69.37 58.99,67.79 59.05,67.72 59.05,66.04 S1.A3
(copper drawn outside any net)
  shapes: Top area x5

### Text on the board
tPlace: v0.2 / 18 May 2020 | offsets / by nantonos